# EAGLE design DWM1000_2 (EAGLE 8.6.0)
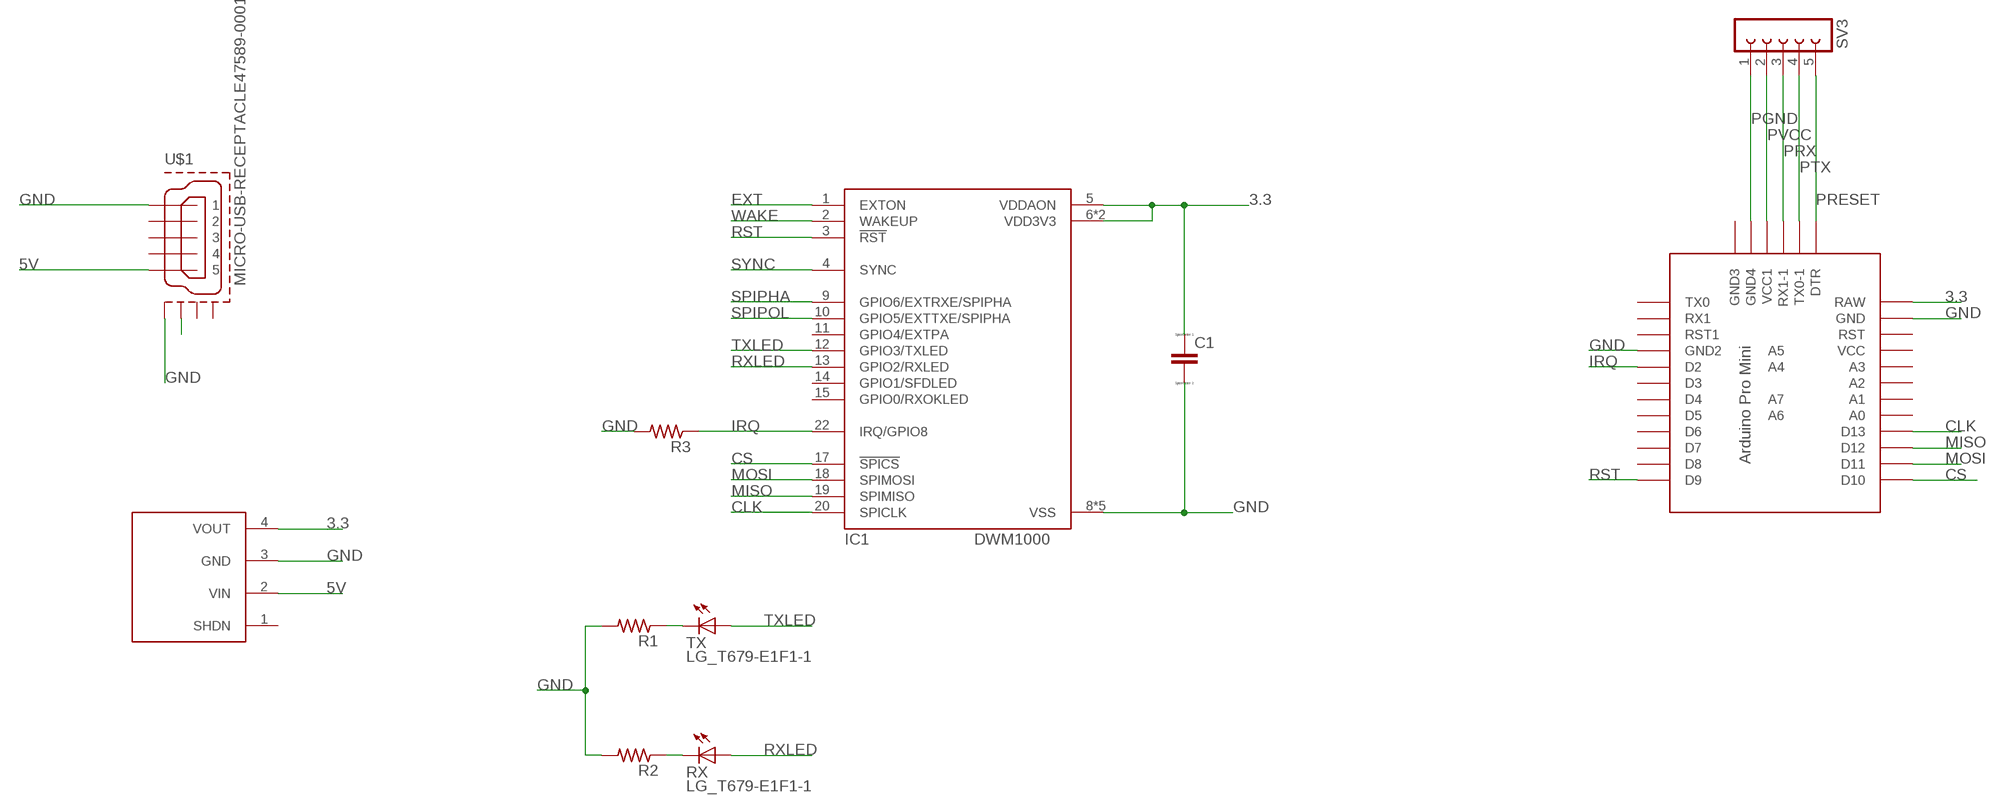
[diagram p0: schematic, sheet 1]

## Parts
C1  CC1206  [C1206]
IC1  DWM1000  [DWM1000]
R1  R-US_M0805  [M0805]
R2  R-US_M0805  [M0805]
R3  R-US_M0805  [M0805]
RX  LG_T679-E1F1-1  [PLCC2]
SV3  FE05-1  [FE05-1]
TX  LG_T679-E1F1-1  [PLCC2]
U$1  MICRO-USB-RECEPTACLE47589-0001  [47589-0001]
U$2  PRO-MINI-2  [PRO-MINI-2]
U$3  D24V5F3  [D24V5F3]

## Nets
3.3: C1.1 IC1.5(VDDAON) IC1.6(VDD3V3) IC1.7(VDD3V3) U$2.RAW U$3.4(VOUT)
5V: U$1.5 U$3.2(VIN)
CLK: IC1.20(SPICLK) U$2.D13
CS: IC1.17(!SPICS) U$2.D10
EXT: IC1.1(EXTON)
GND: C1.2 IC1.8(VSS) IC1.16(VSS) IC1.21(VSS) IC1.23(VSS) IC1.24(VSS) R1.2 R2.2 R3.2 U$1.1 U$1.CASING1(GND1) U$2.GND U$2.GND1(GND2) U$3.3(GND)
IRQ: IC1.22(IRQ/GPIO8) R3.1 U$2.D2
MISO: IC1.19(SPIMISO) U$2.D12
MOSI: IC1.18(SPIMOSI) U$2.D11
N$1: R1.1 TX.C
N$2: R2.1 RX.C
N$3: U$1.CASING2(GND2)
PGND: SV3.1 U$2.GND3(GND4)
PRESET: SV3.5 U$2.DTR
PRX: SV3.3 U$2.RX1-1
PTX: SV3.4 U$2.TX0-1
PVCC: SV3.2 U$2.VCC1
RST: IC1.3(!RST) U$2.D9
RXLED: IC1.13(GPIO2/RXLED) RX.A
SPIPHA: IC1.9(GPIO6/EXTRXE/SPIPHA)
SPIPOL: IC1.10(GPIO5/EXTTXE/SPIPHA)
SYNC: IC1.4(SYNC)
TXLED: IC1.12(GPIO3/TXLED) TX.A
WAKE: IC1.2(WAKEUP)
Unconnected: IC1.11(GPIO4/EXTPA) IC1.14(GPIO1/SFDLED) IC1.15(GPIO0/RXOKLED) U$1.2 U$1.3 U$1.4 U$1.CASING3(GND3) U$1.CASING4(GND4) U$2.A0 U$2.A1 U$2.A2 U$2.A3 U$2.A4 U$2.A5 U$2.A6 U$2.A7 U$2.D3 U$2.D4 U$2.D5 U$2.D6 U$2.D7 U$2.D8 U$2.GND2(GND3) U$2.RST U$2.RST1 U$2.RX1 U$2.TX0 U$2.VCC U$3.1(SHDN)

## Library data of the parts
C1 = eagle-ltspice:C: CAPACITOR, European symbol; SPICEMODEL: NONE; SPICEPREFIX: C
IC1 = decawave:DWM1000
R1-R3 = rcl:R-US_: RESISTOR, American symbol; SPICEPREFIX: R
RX TX = led:*_T679-?-1: LC TOPLED® Low Current LED Source: http://catalog.osram-os.com .. LG_LS_LY_T679_OBS.pdf; COLOR: green
SV3 = con-lsta:FE05-1: FEMALE HEADER; OC_FARNELL: unknown; OC_NEWARK: unknown
U$1 = con-molex-usb:MICRO-USB-RECEPTACLE: MICRO USB RECEPTACLES Micro-USB Receptacles, SMT, Lead-Free from MOLEX <http://www.molex.com/>. (C) 2014 Tomasz Boleslaw CEDRO, cederom@tlen.pl, http://www.tomek.cedro.info. Version 0.1 (2014-01-17): Initial release. Version 0.2 (2014-02-06): Updated 47589-0001 footprint pins/pads/milling. Following devices are included: 1. 47589-0001 Micro-USB AB Receptacle, Bottom Mount, SMT, Lead-Free <http://www.molex.com/molex/products/datasheet.jsp?part=active/0475890001_IO_CONNECTORS.xml> (Technical Drawing <http://www.molex.com/pdm_docs/sd/475890001_sd.pdf>).
U$2 = Arduino-clone:PRO-MINI-2: Arduino Pro Mini Layout 2 Sparkfun.com
U$3 = mylib:D24V5F3

## Board
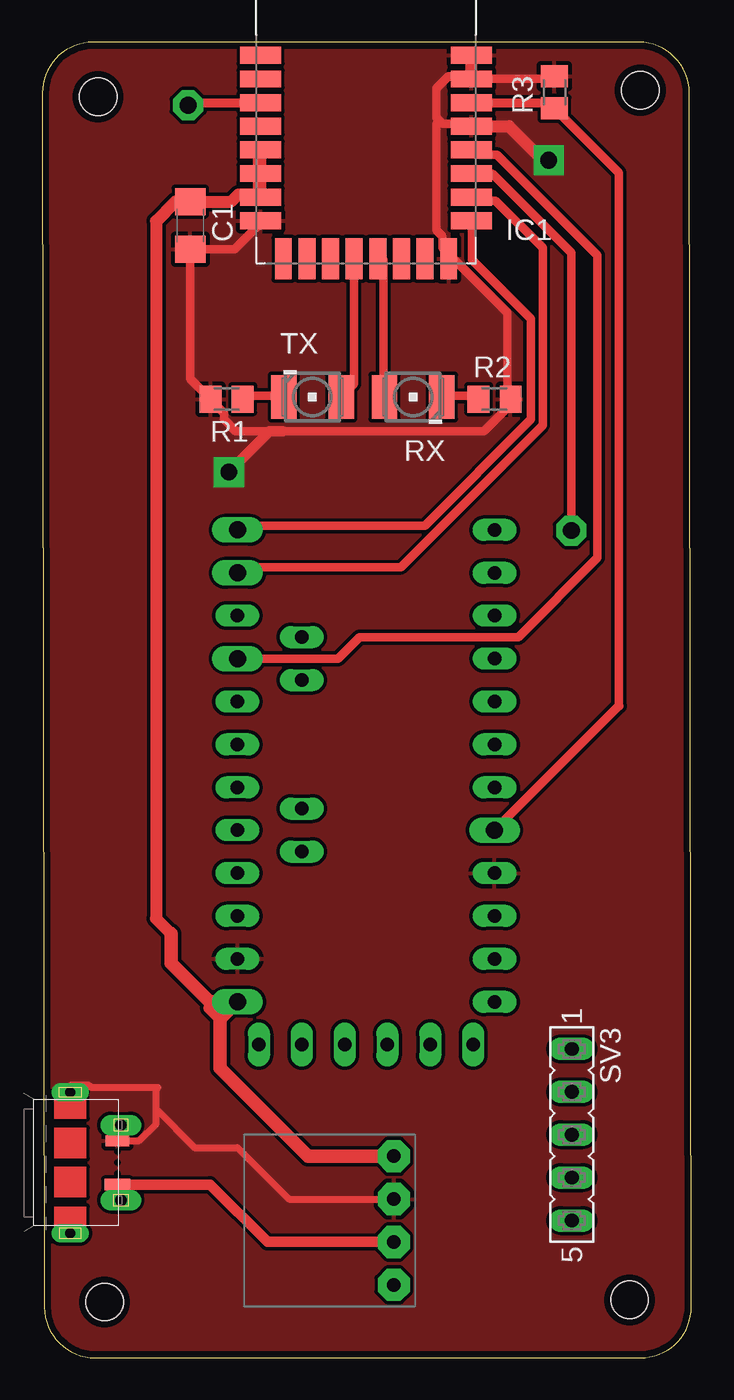
[diagram p1: board, top side]
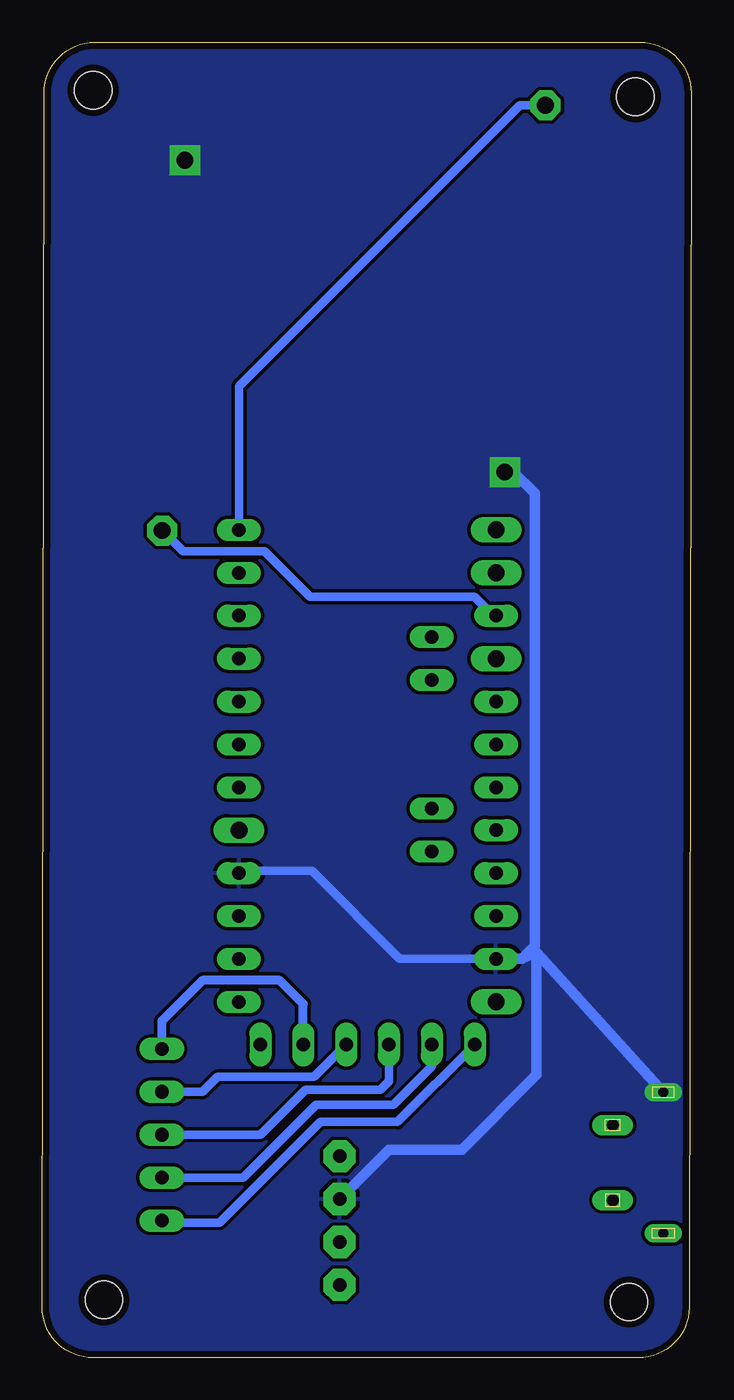
[diagram p2: board, bottom side, seen from below]

Size 38.45 x 77.9 mm. Coordinates in mm from the lower left corner, seen from the top.
Outline: 0,74.9 0.12,2.99 arc90 3.12,0 35.45,0 arc90 38.45,3.01 38.33,74.91 arc90 35.33,77.9 3,77.9 arc90 0,74.9
Copper layers (1*16): Top 0.035mm / dielectric 1.5mm / Bottom 0.035mm
Design rules "default *": minimum track width 0.5mm, minimum drill 0.35mm, track to track 0.2mm, track to pad 0.2mm, pad to pad 6mil, via to via 6mil, smd to smd 6mil, copper to edge 0.4mm, drill to drill 6mil, minimum pad ring 10mil, minimum via ring 8mil, stop-mask expansion 4mil, vias tented up to drill 0mil, thermal gap 10mil
Holes 2.2 mm at 3.3,74.68 3.68,3.3 34.79,3.43 35.43,75.06

### Footprints (pad centres in the part's own frame; a part is rotated, then mirrored left to right if it is on the bottom)
C1206 = smd 1.6 x 1.8: 1 -1.4,0; 2 1.4,0
DWM1000 = smd 2.45 x 1: 1 -6.25,0.8; 2 -6.25,-0.6; 3 -6.25,-2; 4 -6.25,-3.4; 5 -6.25,-4.8; 6 -6.25,-6.2; 7 -6.25,-7.6; 8 -6.25,-9; 17 6.25,-9; 18 6.25,-7.6; 19 6.25,-6.2; 20 6.25,-4.8; 21 6.25,-3.4; 22 6.25,-2; 23 6.25,-0.6; 24 6.25,0.8 | smd 1 x 2.45: 9 -4.9,-11.25; 10 -3.5,-11.25; 11 -2.1,-11.25; 12 -0.7,-11.25; 13 0.7,-11.25; 14 2.1,-11.25; 15 3.5,-11.25; 16 4.9,-11.25
M0805 = smd 1.3 x 1.6: 1 -0.95,0; 2 0.95,0
PLCC2 = smd 2.6 x 1.5: A 0,1.7; C 0,-1.7
FE05-1 = drill 0.813 long: 1 -5.08,0; 2 -2.54,0; 3 0,0; 4 2.54,0; 5 5.08,0
47589-0001 = smd 1.397 x 0.66: 1 2.8,1.3 | smd 0 x 0: 2 2.8,0.65; 3 2.8,0; 4 2.8,-0.65 | smd 1.524 x 0.66: 5 2.8,-1.3 | drill 0.6 pad 0.95 long: CASING1 0,4.175; CASING2 0,-4.175 | drill 0.7 pad 0.762 long: CASING3 3,2.225; CASING4 3,-2.225
PRO-MINI-2 = drill 0.8 long: A0 6.35,2.54; A1 6.35,0; A2 6.35,-2.54; A3 6.35,-5.08; A4 2.54,1.27; A5 2.54,3.81; A6 2.54,-8.89; A7 2.54,-6.35; D3 -8.89,0; D4 -8.89,-2.54; D5 -8.89,-5.08; D6 -8.89,-7.62; D7 -8.89,-10.16; D8 -8.89,-12.7; D9 -8.89,-15.24; D12 6.35,-10.16; DTR 5.08,15.24; GND 6.35,10.16; GND1 -8.89,5.08; GND2 -7.62,15.24; GND3 -5.08,15.24; RST 6.35,7.62; RST1 -8.89,7.62; RX1 -8.89,10.16; RX1-1 0,15.24; TX0 -8.89,12.7; TX0-1 2.54,15.24; VCC 6.35,5.08; VCC1 -2.54,15.24 | drill 1 long: D2 -8.89,2.54; D10 6.35,-15.24; D11 6.35,-12.7; D13 6.35,-7.62; RAW 6.35,12.7
D24V5F3 = drill 0.8 pad 1.905 octagon: 1 -3.81,-3.81; 2 -1.27,-3.81; 3 1.27,-3.81; 4 3.81,-3.81

### Placement (x,y rotation side)
C1  8.76,67.06 270 top
IC1  19.17,76.33 0 top
R1  10.92,56.77 180 top
R2  26.79,56.77 0 top
R3  30.35,74.93 90 top
RX  21.97,56.9 90 top
SV3  31.36,13.21 270 top
TX  16,56.9 270 top
U$1  1.65,11.56 0 top
U$2  17.9,33.78 180 top
U$3  17.01,8.13 90 top

### Tracks (layer width: path | path; a pad name or v marks a point on that pad's centre or on a via)
3.3
  Top 0.5: IC1.5 12.85,71.33 12.85,70.28 IC1.6 12.85,69.93 12.85,68.88 IC1.7
  Top 0.508: 12.06,68.88 12.85,68.88
  Top 0.61: IC1.7 12.77,68.88 12.06,68.88 | C1.1 7.87,68.46
  Top 0.711: 12.06,68.88 11.59,68.88 11.17,68.46 C1.1 | 7.87,68.46 6.73,67.31 6.73,26 7.62,25.11 | 9.9,21.08 9.9,20.7 10.54,20.07
  Top 0.8: IC1.5 12.85,71.46 12.85,69.93 | IC1.6 12.85,70.06 12.85,68.88 | 7.6,25.13 7.62,25.11 7.62,23.37 9.9,21.08 U$2.RAW 10.54,20.07 10.54,17.15 15.74,11.94 U$3.4
5V
  Top 0.61: U$1.5 9.93,10.26 13.33,6.86 U$3.2
CLK
  Top 0.508: IC1.20 25.7,71.25 26.92,71.25 32.89,65.28 32.89,47.37 28.19,42.67 18.79,42.67 17.52,41.4 U$2.D13
CS
  Top 0.5: IC1.17 25.45,67.13 25.45,65.03 28.95,61.53 28.95,55.58 22.65,49.28 11.8,49.28 U$2.D10
GND  (via drill 1 pad 1.78)
  Top 0.406: U$1.1 5.74,12.86 6.73,13.84 6.73,14.73 | 6.73,14.73 6.73,15.88 6.85,16 2.9,16 2.76,16.14 1.65,16.14 | 6.73,14.73 9.01,12.45 11.55,12.45 14.6,9.4 U$3.3
  Top 0.5: 12.15,66.43 12.85,67.13 IC1.8 | 25.45,73.08 IC1.21 25.1,73.08 23.7,73.08 23.53,73.25 | 23.53,73.25 23.35,73.43 23.35,75.18 24.05,75.88 25.1,75.88 IC1.23 | 23.53,73.25 23.35,73.08 23.35,66.78 23.7,66.43 23.7,65.73 24.05,65.38 IC1.16 24.4,65.03 27.55,61.88 27.55,56.98 R2.2 27.9,56.63 26.15,54.88 14.22,54.88 11.45,54.88 10.75,55.58 10.75,55.93 10.05,56.63 R1.2
  Top 0.508: IC1.23 30.2,75.73 R3.2 | 12.85,67.13 11.38,65.66 C1.2 8.76,57.98 R1.2
  Top 0.61: v11.04,52.45 13.47,54.88 14.22,54.88
  Top 0.711: IC1.21 27.65,72.93 29.66,70.92 v30,70.92 | IC1.23 IC1.24
  Bottom 0.508: U$2.GND 17.27,23.62 22.47,28.83 26.67,28.83 U$2.GND1
  Bottom 0.61: U$2.GND 10.03,23.62 | 10.03,23.62 9.27,24.38 9.27,51.18 10.54,52.45 v11.04,52.45 | U$1.CASING1 9.16,24 | 9.16,24 10.03,23.62 | U$3.3 17.9,12.32 13.58,12.32 9.16,16.75 9.16,24
  pour Bottom: 41.78,79.38 41.78,-1.14 -4.07,-0.89 -4.07,79.88
  pour Top: -2.29,78.49 39.49,78.23 39.62,-3.43 -2.16,-3.17
IRQ
  Top 0.508: 30,74.33 R3.1 34.16,70.17 34.16,38.61
  Top 0.533: IC1.22 30,74.33 | 34.16,38.61 U$2.D2
MISO  (via drill 1 pad 1.78)
  Top 0.508: IC1.19 26.65,70.13 31.34,65.44 v31.34,48.99
  Bottom 0.5: 12.85,45.08 12.15,44.38 12.15,44.03 11.8,43.68 U$2.D12
  Bottom 0.508: 12.85,45.08 22.59,45.08 25.27,47.75 30.1,47.75 v31.34,48.99
MOSI
  Top 0.5: IC1.18 25.45,68.53 26.85,68.53 29.65,65.73 29.65,55.23 21.25,46.83 11.8,46.83 U$2.D11
N$1
  Top 0.5: R1.1 12.15,56.98 14.25,56.98 TX.C
N$2
  Top 0.5: R2.1 25.8,56.98 23.7,56.98 RX.C
PGND
  Bottom 0.533: U$2.GND3 22.98,20.96 24.38,22.35 28.95,22.35 31.36,19.94 SV3.1
PRESET
  Bottom 0.5: U$2.DTR 17.39,13.97 21.97,13.97 27.94,8 31.24,8 SV3.5
PRX
  Top 0.5: 18.1,18.48 U$2.RX1-1
  Bottom 0.5: U$2.RX1-1 17.9,16.38 18.41,15.88 22.86,15.88 25.52,13.21 SV3.3
PTX
  Bottom 0.5: SV3.4 26.54,10.67 22.22,14.99 17.65,14.99 15.36,17.27 U$2.TX0-1
PVCC
  Bottom 0.5: U$2.VCC1 22.35,16.64 28.06,16.64 28.95,15.75 SV3.2
RST  (via drill 1 pad 1.78)
  Top 0.508: v8.63,74.17 8.79,74.33
  Top 0.533: 8.79,74.33 IC1.3
  Bottom 0.508: U$2.D9 26.79,57.53 10.16,74.17 v8.63,74.17 8.5,74.17
RXLED
  Top 0.5: IC1.13 20.2,65.03 20.2,56.98 RX.A
TXLED
  Top 0.5: IC1.12 18.45,65.03 18.45,57.68 17.75,56.98 TX.A

### Text on the board
Document: Mikael & Filip | Prog in | Power in | GND | VCC | RX | TX | RST